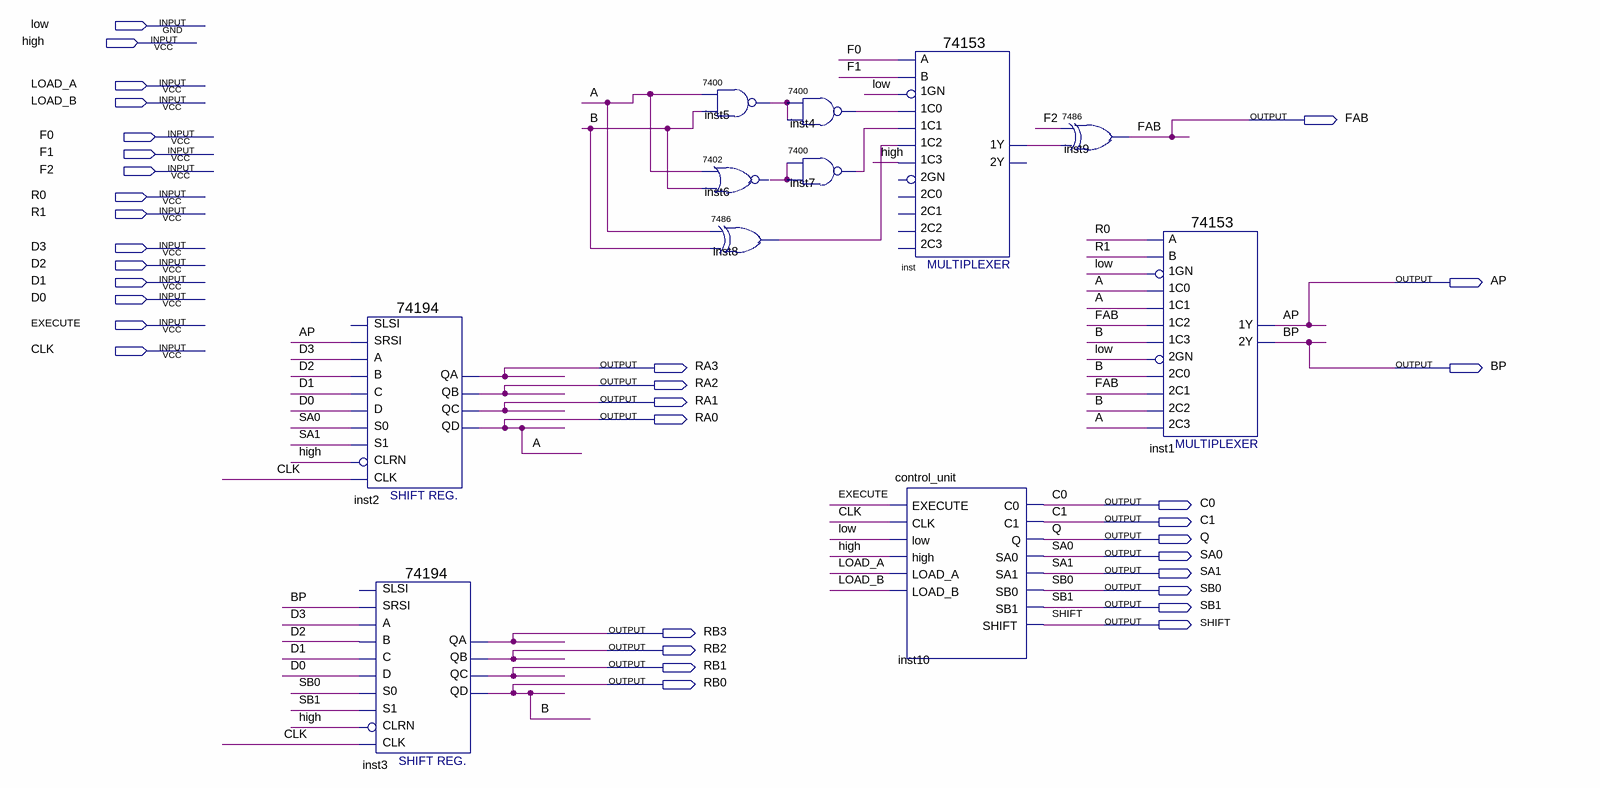
[diagram p0: schematic sheet]
// Quartus schematic lab3.bdf as structural Verilog: 11 symbols, 34 pins
module lab3 (
  input  low,
  input  high,
  input  LOAD_A,
  input  LOAD_B,
  input  F0,
  input  F1,
  input  F2,
  input  R0,
  input  R1,
  input  D3,
  input  D2,
  input  D1,
  input  D0,
  input  EXECUTE,
  input  CLK,
  output FAB,
  output AP,
  output RA3,
  output BP,
  output RA2,
  output RA1,
  output RA0,
  output C0,
  output C1,
  output Q,
  output SA0,
  output SA1,
  output SB0,
  output SB1,
  output SHIFT,
  output RB3,
  output RB2,
  output RB1,
  output RB0
);

  wire inst4_1, inst5_1, inst6_1, inst7_1, inst8_1, inst_1y;

  \74194  inst2 (
    .SRSI(AP), .B(D2), .C(D1), .CLK(CLK), .CLRN(high), .D(D0), .S1(SA1), .S0(SA0), .A(D3), .QA(RA3),
    .QB(RA2), .QC(RA1), .QD(RA0));  // open: SLSI
  \74194  inst3 (
    .SRSI(BP), .B(D2), .C(D1), .CLK(CLK), .CLRN(high), .D(D0), .S1(SB1), .S0(SB0), .A(D3), .QA(RB3),
    .QB(RB2), .QC(RB1), .QD(RB0));  // open: SLSI
  \7400  inst5 (.\3 (RB0), .\2 (RA0), .\1 (inst5_1));
  \7402  inst6 (.\2 (RA0), .\3 (RB0), .\1 (inst6_1));
  \7486  inst8 (.\2 (RA0), .\3 (RB0), .\1 (inst8_1));
  \7400  inst4 (.\3 (inst5_1), .\2 (inst5_1), .\1 (inst4_1));
  \7400  inst7 (.\3 (inst6_1), .\2 (inst6_1), .\1 (inst7_1));
  control_unit inst10 (
    .EXECUTE(EXECUTE), .CLK(CLK), .low(low), .high(high), .LOAD_A(LOAD_A), .LOAD_B(LOAD_B), .C0(C0), .C1(C1),
    .Q(Q), .SA0(SA0), .SA1(SA1), .SB0(SB0), .SB1(SB1), .SHIFT(SHIFT));
  \74153  inst (
    .\1C1 (inst7_1), .\1GN (low), .\1C0 (inst4_1), .\1C2 (inst8_1), .\1C3 (high), .B(F1), .A(F0),
    .\1Y (inst_1y));  // open: 2C0, 2GN, 2C2, 2C1, 2C3, 2Y
  \7486  inst9 (.\2 (F2), .\3 (inst_1y), .\1 (FAB));
  \74153  inst1 (
    .\1C1 (RA0), .\1GN (low), .\1C0 (RA0), .\2C0 (RB0), .\2GN (low), .\2C2 (RB0), .\1C2 (FAB), .\1C3 (RB0),
    .B(R1), .A(R0), .\2C1 (FAB), .\2C3 (RA0), .\1Y (AP), .\2Y (BP));

  // Other names for the same wires on the sheet: A = RA0; B = RB0
endmodule
